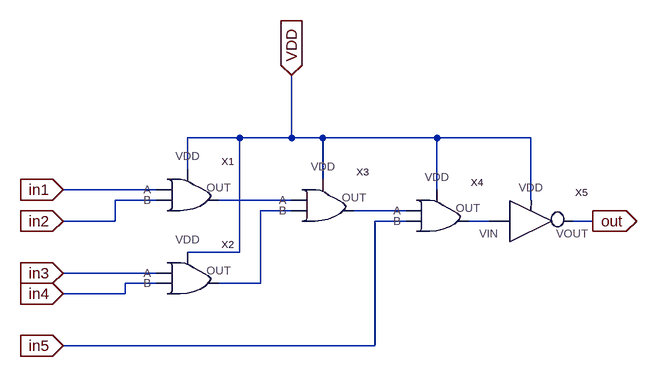
[diagram p0: schematic nor5.asc]
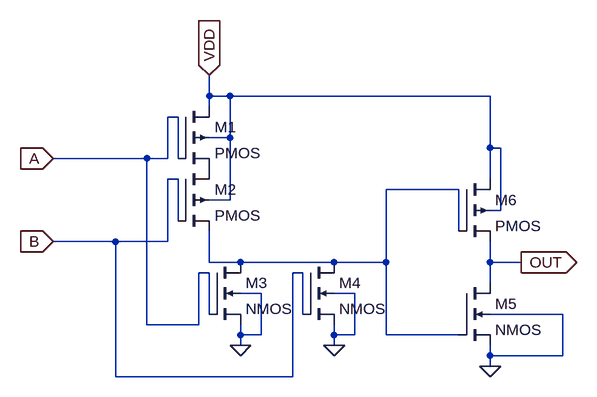
[diagram p1: sub-circuit or.asc]
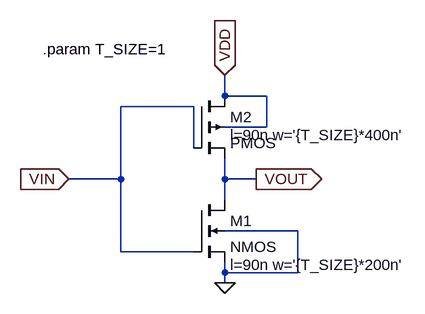
[diagram p2: sub-circuit inverter.asc]
nor5.asc, the LTspice schematic file:
Version 4
SHEET 1 880 680
WIRE 192 16 112 16
WIRE 272 16 272 -80
WIRE 272 16 192 16
WIRE 320 16 272 16
WIRE 496 16 320 16
WIRE 640 16 496 16
WIRE 112 64 112 16
WIRE 320 80 320 16
WIRE 64 96 -80 96
WIRE 496 96 496 16
WIRE 64 112 0 112
WIRE 272 112 160 112
WIRE 640 112 640 16
WIRE 272 128 224 128
WIRE 448 128 368 128
WIRE 0 144 0 112
WIRE 0 144 -80 144
WIRE 448 144 400 144
WIRE 576 144 544 144
WIRE 736 144 704 144
WIRE 192 192 192 16
WIRE 192 192 112 192
WIRE 64 224 -80 224
WIRE 64 240 16 240
WIRE 224 240 224 128
WIRE 224 240 160 240
WIRE 16 256 16 240
WIRE 16 256 -80 256
WIRE 400 336 400 144
WIRE 400 336 -80 336
FLAG -80 96 in1
IOPIN -80 96 In
FLAG -80 144 in2
IOPIN -80 144 In
FLAG -80 224 in3
IOPIN -80 224 In
FLAG -80 256 in4
IOPIN -80 256 In
FLAG -80 336 in5
IOPIN -80 336 In
FLAG 272 -80 VDD
IOPIN 272 -80 In
FLAG 736 144 out
IOPIN 736 144 Out
SYMBOL or 128 112 R0
SYMATTR InstName X1
SYMBOL or 128 240 R0
SYMATTR InstName X2
SYMBOL or 336 128 R0
SYMATTR InstName X3
SYMBOL or 512 144 R0
SYMATTR InstName X4
SYMBOL inverter 640 144 R0
SYMATTR InstName X5

or.asc, the sub-circuit schematic file:
Version 4
SHEET 1 1084 680
WIRE 32 -32 32 -64
WIRE 64 -32 32 -32
WIRE 464 -32 64 -32
WIRE 32 -16 32 -32
WIRE -16 0 -32 0
WIRE 64 32 64 -32
WIRE 64 32 32 32
WIRE 464 48 464 -32
WIRE 480 48 464 48
WIRE -64 64 -208 64
WIRE -32 64 -32 0
WIRE -32 64 -64 64
WIRE -16 64 -16 0
WIRE -16 96 -32 96
WIRE 464 96 464 48
WIRE 416 112 304 112
WIRE 64 128 64 32
WIRE 64 128 32 128
WIRE 480 144 480 48
WIRE 480 144 464 144
WIRE -16 160 -16 96
WIRE 416 176 416 112
WIRE -112 192 -208 192
WIRE -32 192 -32 96
WIRE -32 192 -112 192
WIRE 32 224 32 176
WIRE 80 224 32 224
WIRE 224 224 80 224
WIRE 304 224 304 112
WIRE 304 224 224 224
WIRE 464 224 464 192
WIRE 512 224 464 224
WIRE 32 240 16 240
WIRE 176 240 160 240
WIRE 464 256 464 224
WIRE 112 272 80 272
WIRE 256 272 224 272
WIRE 32 304 32 240
WIRE 176 304 176 240
WIRE 576 304 464 304
WIRE -64 320 -64 64
WIRE 16 320 16 240
WIRE 16 320 -64 320
WIRE 80 336 80 320
WIRE 112 336 112 272
WIRE 112 336 80 336
WIRE 224 336 224 320
WIRE 256 336 256 272
WIRE 256 336 224 336
WIRE 304 336 304 224
WIRE 416 336 304 336
WIRE 80 352 80 336
WIRE 224 352 224 336
WIRE 464 368 464 352
WIRE 576 368 576 304
WIRE 576 368 464 368
WIRE 464 384 464 368
WIRE -112 400 -112 192
WIRE 160 400 160 240
WIRE 160 400 -112 400
FLAG 32 -64 VDD
IOPIN 32 -64 In
FLAG 80 352 0
FLAG 224 352 0
FLAG -208 64 A
IOPIN -208 64 In
FLAG -208 192 B
IOPIN -208 192 In
FLAG 464 384 0
FLAG 512 224 OUT
IOPIN 512 224 Out
SYMBOL pmos4 -16 -16 R0
SYMATTR InstName M1
SYMATTR Value2 l=90n w=400n
SYMBOL pmos4 -16 80 R0
SYMATTR InstName M2
SYMATTR Value2 l=90n w=400n
SYMBOL nmos4 32 224 R0
SYMATTR InstName M3
SYMATTR Value2 l=90n w=200n
SYMBOL nmos4 176 224 R0
SYMATTR InstName M4
SYMATTR Value2 l=90n w=200n
SYMBOL nmos4 416 256 R0
SYMATTR Value2 l=90n w=200n
SYMATTR InstName M5
SYMBOL pmos4 416 96 R0
SYMATTR Value2 l=90n w=400n
SYMATTR InstName M6

inverter.asc, the sub-circuit schematic file:
Version 4
SHEET 1 880 680
WIRE 176 -128 176 -160
WIRE 240 -128 176 -128
WIRE 128 -112 16 -112
WIRE 240 -80 240 -128
WIRE 240 -80 176 -80
WIRE 128 -48 128 -112
WIRE 16 0 16 -112
WIRE 16 0 -64 0
WIRE 176 0 176 -32
WIRE 224 0 176 0
WIRE 176 32 176 0
WIRE 288 80 176 80
WIRE 16 112 16 0
WIRE 128 112 16 112
WIRE 176 144 176 128
WIRE 288 144 288 80
WIRE 288 144 176 144
WIRE 176 160 176 144
FLAG 176 160 0
FLAG -64 0 VIN
IOPIN -64 0 In
FLAG 224 0 VOUT
IOPIN 224 0 Out
FLAG 176 -160 VDD
IOPIN 176 -160 In
SYMBOL nmos4 128 32 R0
WINDOW 123 56 100 Left 2
SYMATTR InstName M1
SYMATTR Value2 l=90n w='{T_SIZE}*200n'
SYMBOL pmos4 128 -128 R0
WINDOW 123 56 60 Left 2
SYMATTR InstName M2
SYMATTR Value2 l=90n w='{T_SIZE}*400n'
TEXT -104 -200 Left 2 !.param T_SIZE=1

The netlist it stands for:
* nor5.asc
XX1 in1 in2 VDD N001 or
XX2 in3 in4 VDD N002 or
XX3 N001 N002 VDD N003 or
XX4 N003 in5 VDD N004 or
XX5 N004 VDD out inverter

* block symbol definitions
.subckt or A B VDD OUT
M1 VDD A P001 VDD PMOS l=90n w=400n
M2 P001 B N001 VDD PMOS l=90n w=400n
M3 N001 A 0 0 NMOS l=90n w=200n
M4 N001 B 0 0 NMOS l=90n w=200n
M5 OUT N001 0 0 NMOS l=90n w=200n
M6 VDD N001 OUT VDD PMOS l=90n w=400n
.ends or

.subckt inverter VIN VDD VOUT
M1 VOUT VIN 0 0 NMOS l=90n w='{T_SIZE}*200n'
M2 VDD VIN VOUT VDD PMOS l=90n w='{T_SIZE}*400n'
.param T_SIZE=1
.ends inverter

.model NMOS NMOS
.model PMOS PMOS
.lib standard.mos
.backanno
.end